# EAGLE schematic LinearRegulator (EAGLE 6.6.0)
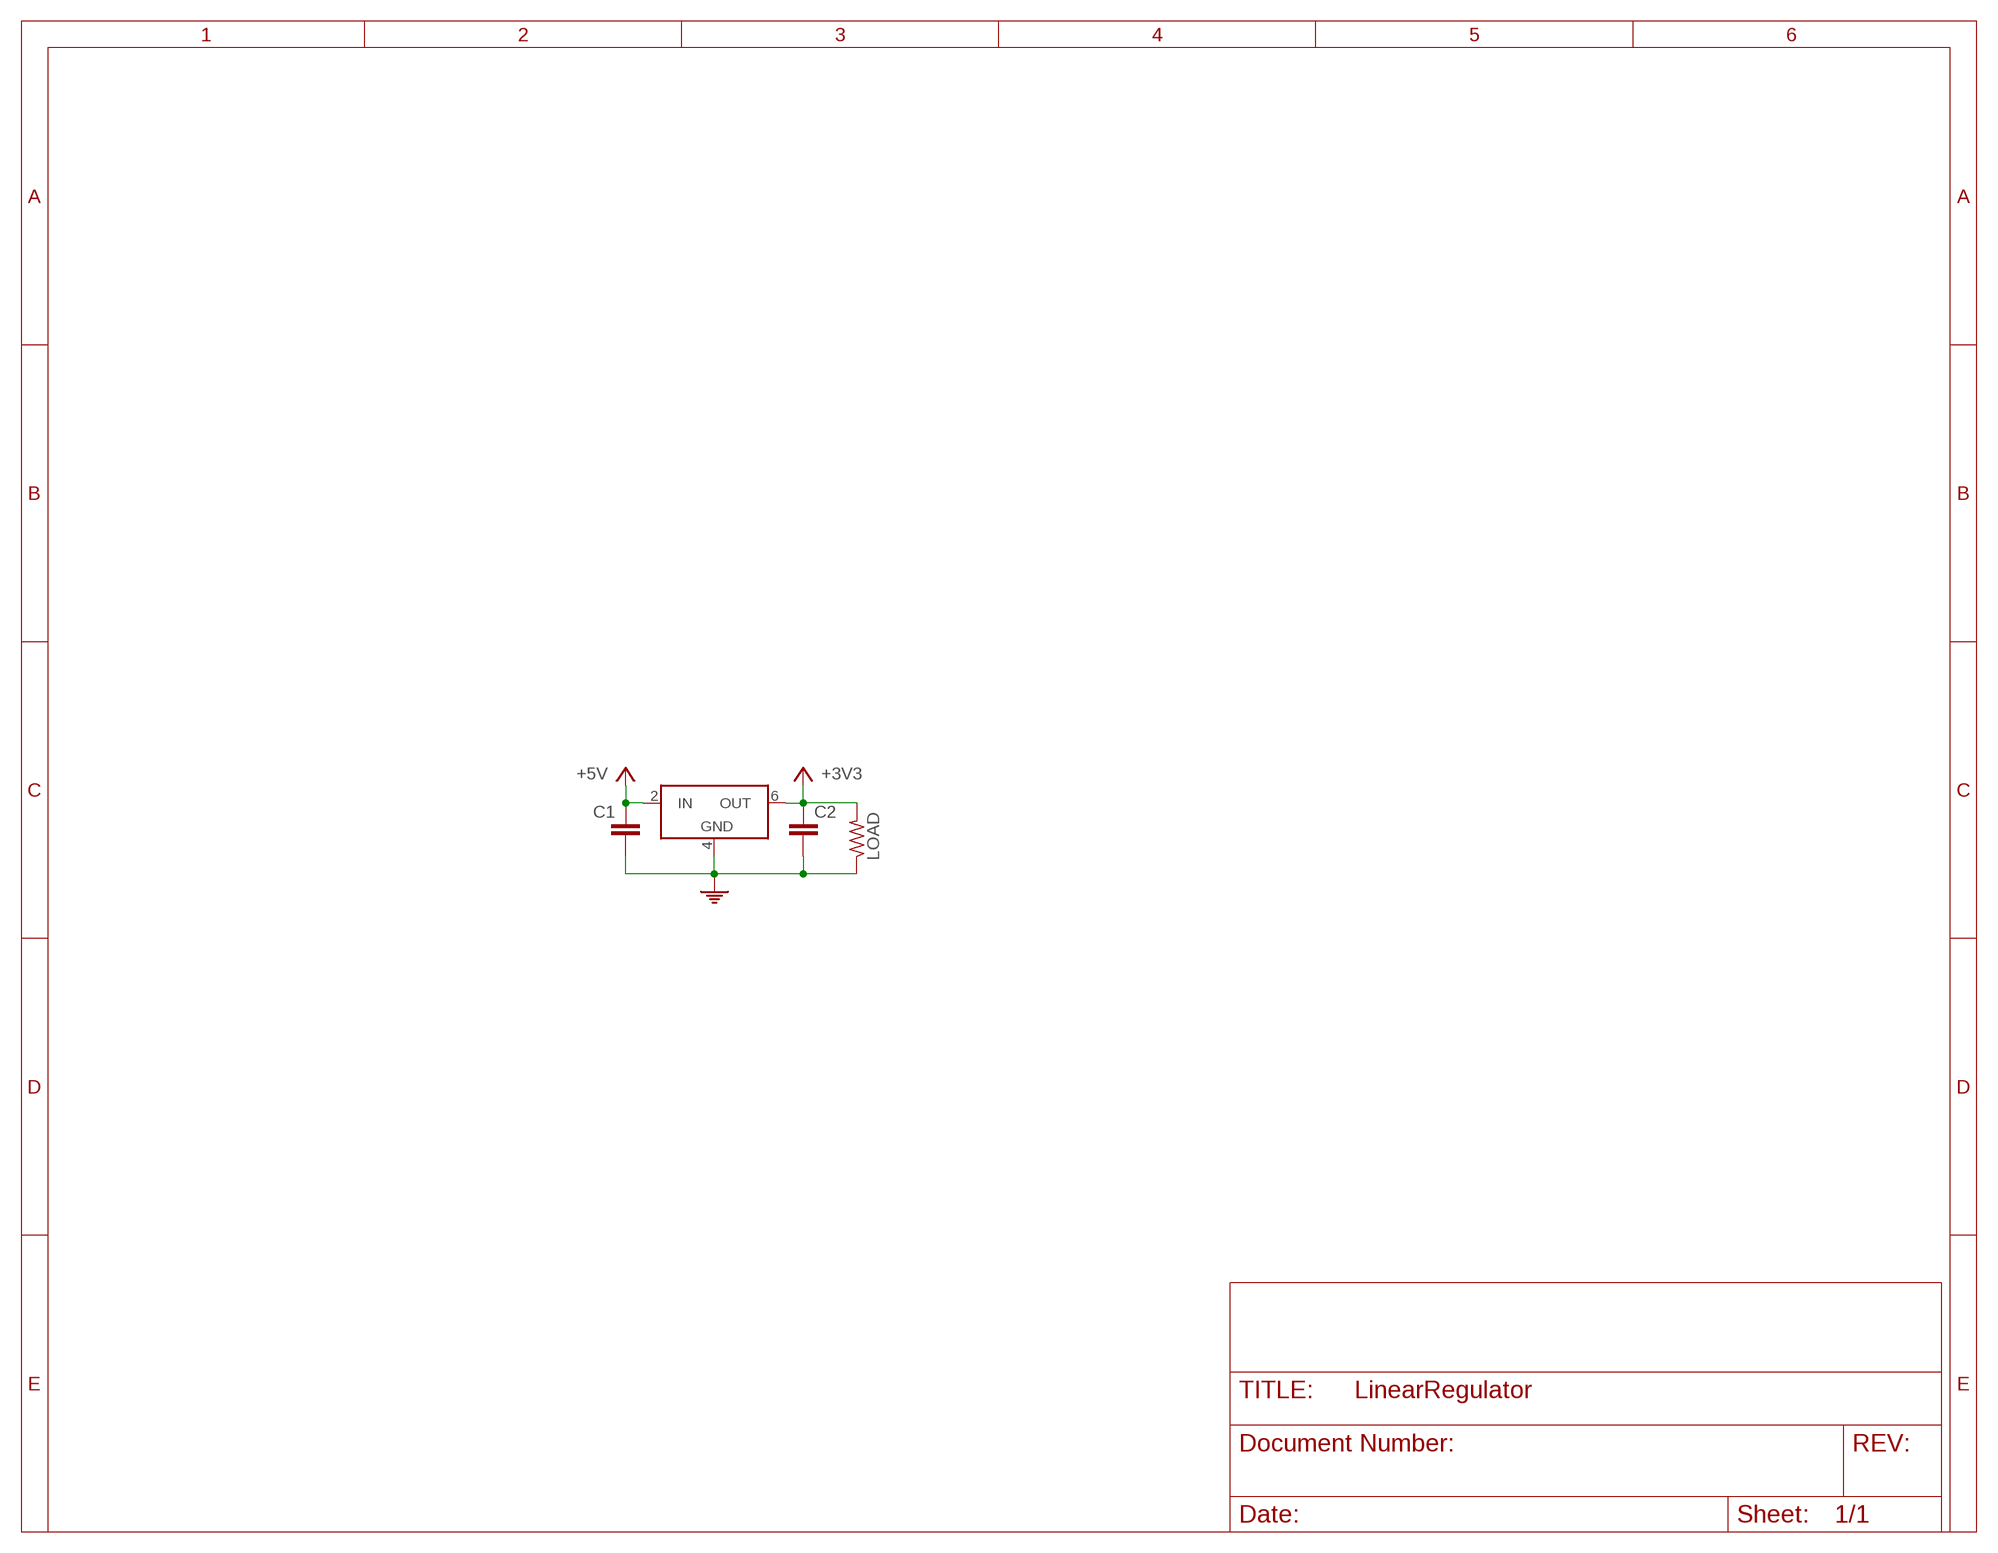
[diagram p0: schematic, sheet 1]

## Parts
C1  C2,5-3  [C2.5-3]
C2  C2,5-3  [C2.5-3]
IC1  LT1021N  [DIL08]
LOAD  R-US_0204/2V  [0204V]

## Nets
+3V3: C2.1 IC1.6(OUT) LOAD.2
+5V: C1.1 IC1.2(IN)
PE: C1.2 C2.2 IC1.4(GND) LOAD.1

## Library data of the parts
C1 C2 = capacitor-wima:C: CAPACITOR naming: grid - package width
IC1 = linear-technology:LT1021: Precision Reference Source: http://www.linear.com/pc/downloadDocument.do?navId=H0,C1,C1010,C1603,P1229,D2805; MPN: LT1021BCN8-5#PBF; OC_FARNELL: 1273427; OC_NEWARK: 24M3927
LOAD = rcl:R-US_: RESISTOR, American symbol